# EAGLE schematic User Port (EAGLE 9.6.2)
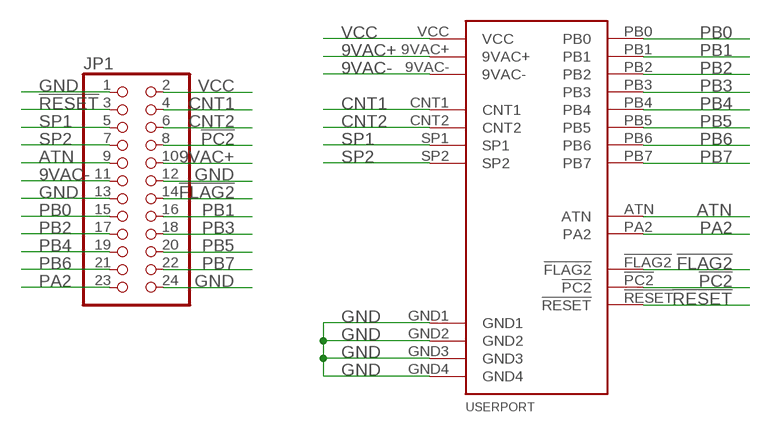
[diagram p0: schematic, sheet 1]

## Parts
JP1  PINHD-2X12  [2X12]
USERPORT  C64_USER  [C64_USER]

## Nets
9VAC+: JP1.10 USERPORT.9VAC+
9VAC-: JP1.11 USERPORT.9VAC-
!FLAG2: JP1.14 USERPORT.!FLAG2
!PC2: JP1.8 USERPORT.!PC2
!RESET: JP1.3 USERPORT.!RESET
ATN: JP1.9 USERPORT.ATN
CNT1: JP1.4 USERPORT.CNT1
CNT2: JP1.6 USERPORT.CNT2
GND: JP1.1 JP1.12 JP1.13 JP1.24 USERPORT.GND1 USERPORT.GND2 USERPORT.GND3 USERPORT.GND4
PA2: JP1.23 USERPORT.PA2
PB0: JP1.15 USERPORT.PB0
PB1: JP1.16 USERPORT.PB1
PB2: JP1.17 USERPORT.PB2
PB3: JP1.18 USERPORT.PB3
PB4: JP1.19 USERPORT.PB4
PB5: JP1.20 USERPORT.PB5
PB6: JP1.21 USERPORT.PB6
PB7: JP1.22 USERPORT.PB7
SP1: JP1.5 USERPORT.SP1
SP2: JP1.7 USERPORT.SP2
VCC: JP1.2 USERPORT.VCC

## Library data of the parts
JP1 = pinhead:PINHD-2X12: PIN HEADER
USERPORT = 0myparts:C64_USER